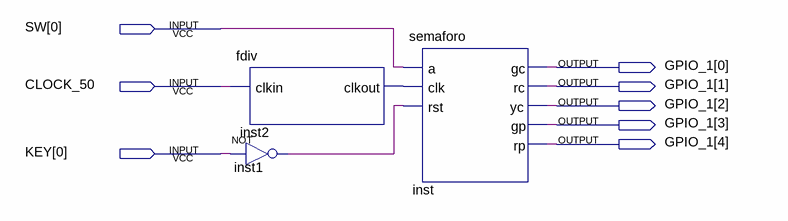
[diagram p0: schematic sheet]
// Quartus schematic Exp10.bdf as structural Verilog: 3 symbols, 8 pins
module Exp10 (
  input  [0:0] SW,
  input  CLOCK_50,
  input  [0:0] KEY,
  output [4:0] GPIO_1
);

  wire inst1_out, inst2_clkout;

  fdiv inst2 (.clkin(CLOCK_50), .clkout(inst2_clkout));
  not inst1 (inst1_out, KEY[0]);
  semaforo inst (
    .a(SW[0]), .clk(inst2_clkout), .rst(inst1_out), .gc(GPIO_1[0]), .rc(GPIO_1[1]), .yc(GPIO_1[2]),
    .gp(GPIO_1[3]), .rp(GPIO_1[4]));
endmodule
